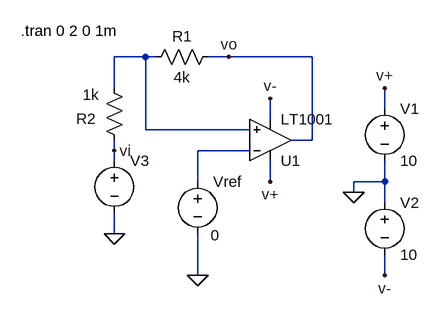
[diagram p0: schematic comparadores5.asc]
comparadores5.asc, the LTspice schematic file:
Version 4
SHEET 1 1884 820
WIRE 48 160 0 160
WIRE 64 160 48 160
WIRE 176 160 144 160
WIRE 304 160 176 160
WIRE 0 208 0 160
WIRE 416 240 416 208
WIRE 240 256 240 224
WIRE 48 272 48 160
WIRE 208 272 48 272
WIRE 304 288 304 160
WIRE 304 288 272 288
WIRE 0 304 0 288
WIRE 208 304 128 304
WIRE 0 320 0 304
WIRE 128 352 128 304
WIRE 240 352 240 320
WIRE 416 352 416 320
WIRE 416 352 368 352
WIRE 368 368 368 352
WIRE 416 384 416 352
WIRE 0 432 0 400
WIRE 128 496 128 432
WIRE 416 496 416 464
FLAG 0 432 0
FLAG 128 496 0
FLAG 176 160 vo
FLAG 0 304 vi
FLAG 368 368 0
FLAG 416 208 v+
FLAG 240 352 v+
FLAG 416 496 v-
FLAG 240 224 v-
SYMBOL res 160 144 R90
WINDOW 0 0 56 VBottom 2
WINDOW 3 32 56 VTop 2
SYMATTR InstName R1
SYMATTR Value 4k
SYMBOL res -16 192 R0
WINDOW 0 -43 63 Left 2
WINDOW 3 -33 26 Left 2
SYMATTR InstName R2
SYMATTR Value 1k
SYMBOL voltage 128 336 R0
WINDOW 3 20 98 Left 2
WINDOW 123 0 0 Left 2
WINDOW 39 0 0 Left 2
SYMATTR Value 0
SYMATTR InstName Vref
SYMBOL voltage 0 304 R0
WINDOW 3 24 96 Invisible 2
WINDOW 123 0 0 Left 2
WINDOW 39 0 0 Left 2
SYMATTR Value PULSE(-10 10 0 1 1 1u 2.000001)
SYMATTR InstName V3
SYMBOL OpAmps\\LT1001 240 352 M180
SYMATTR InstName U1
SYMBOL voltage 416 224 R0
WINDOW 123 0 0 Left 0
WINDOW 39 0 0 Left 0
SYMATTR InstName V1
SYMATTR Value 10
SYMBOL voltage 416 368 R0
WINDOW 123 0 0 Left 0
WINDOW 39 0 0 Left 0
SYMATTR InstName V2
SYMATTR Value 10
TEXT -144 120 Left 2 !.tran 0 2 0 1m

The netlist it stands for:
* comparadores5.asc
R1 vo N001 4k
R2 N001 vi 1k
Vref N002 0 0
V3 vi 0 PULSE(-10 10 0 1 1 1u 2.000001)
XU1 N001 N002 v+ v- vo LT1001  ; pins In+ In- V+ V- OUT
V1 v+ 0 10
V2 0 v- 10
.tran 0 2 0 1m
.lib LTC.lib
.backanno
.end